# EasyEDA Pro project ProProject_ExtBoard-002_2024-05-18.epro, board PCB-ExtBoard-002
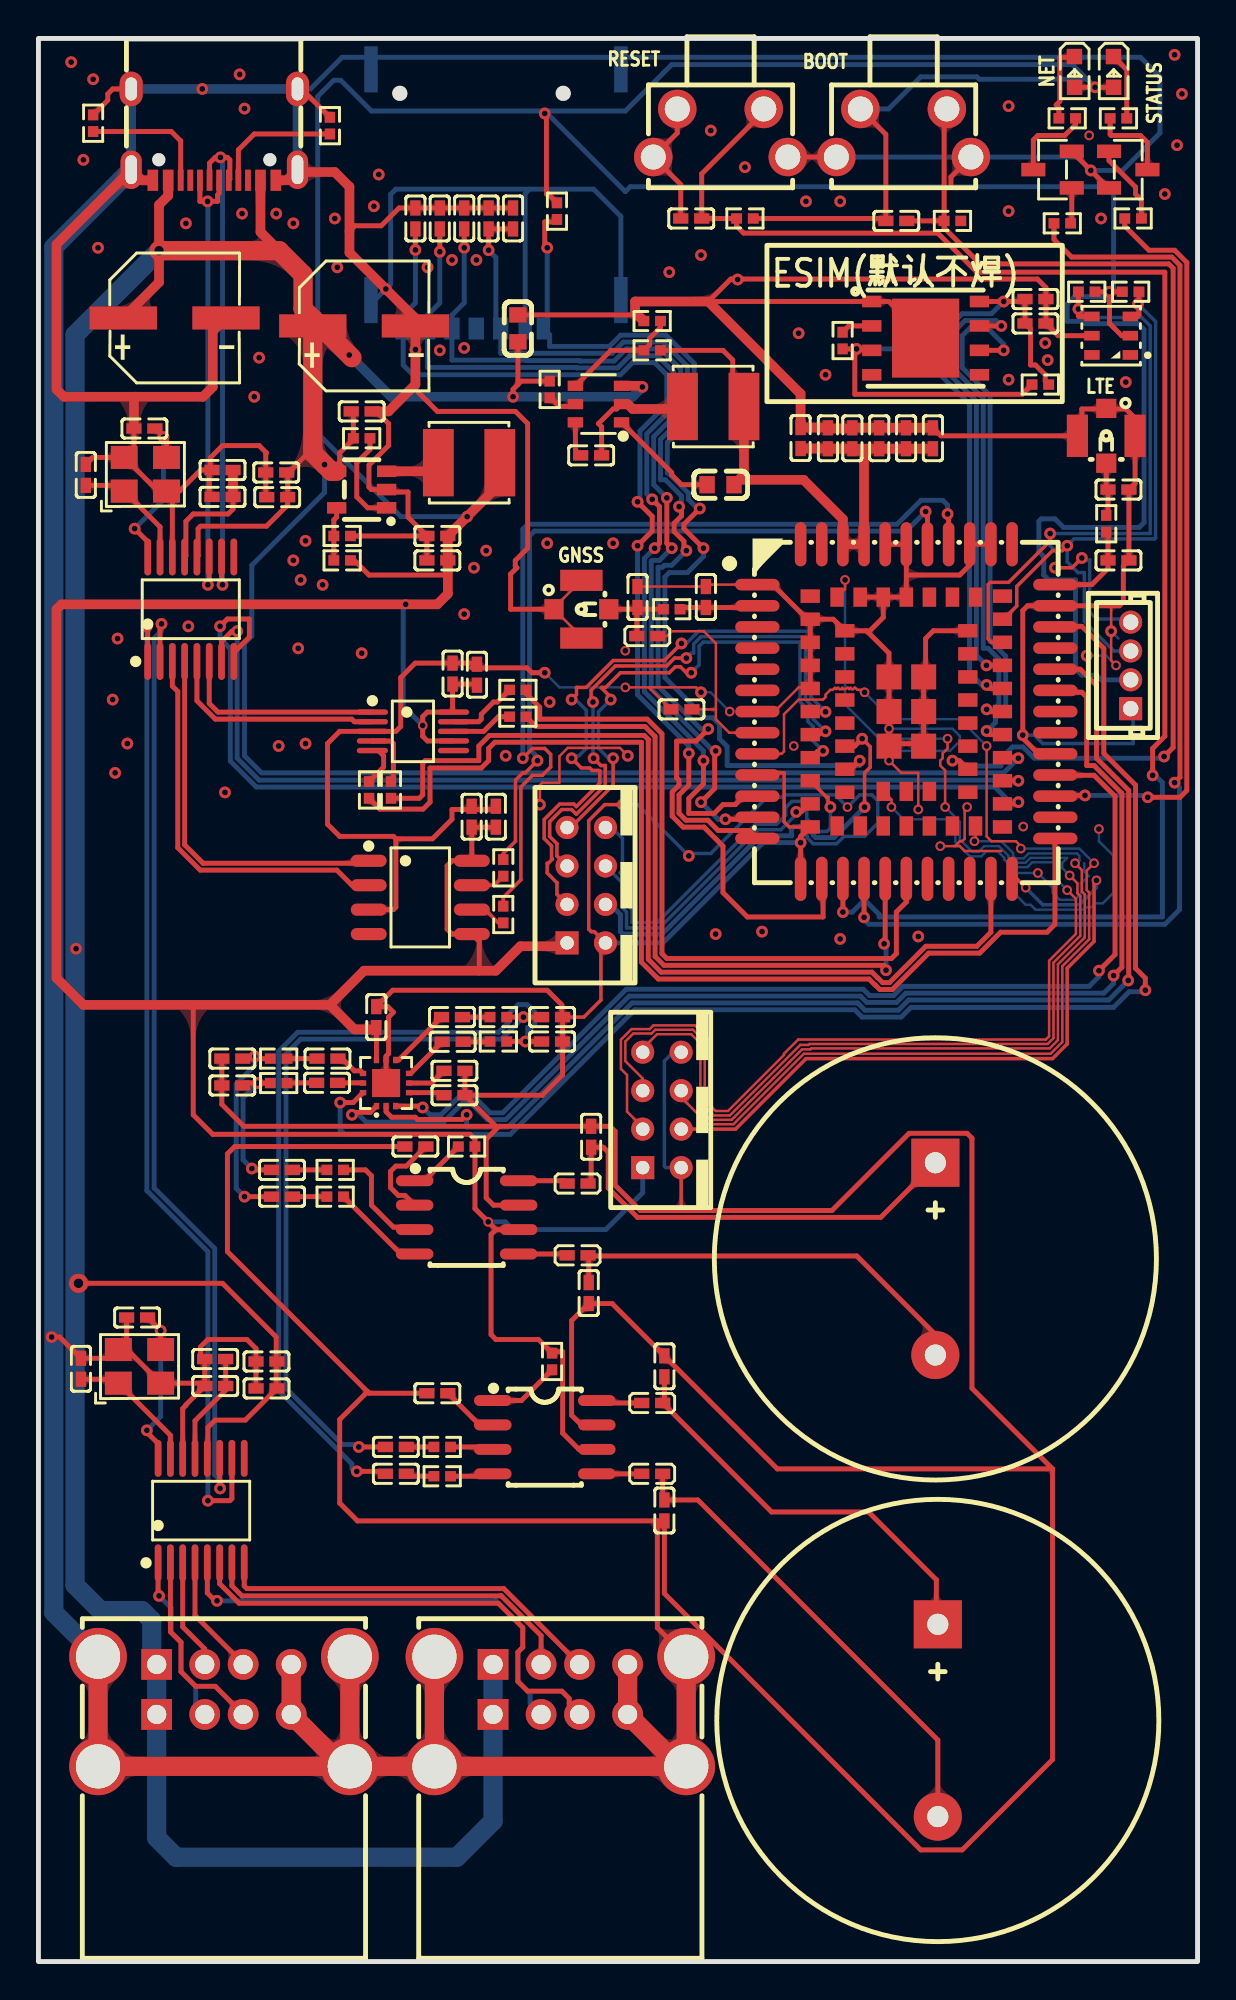
[diagram p5: board, top side]
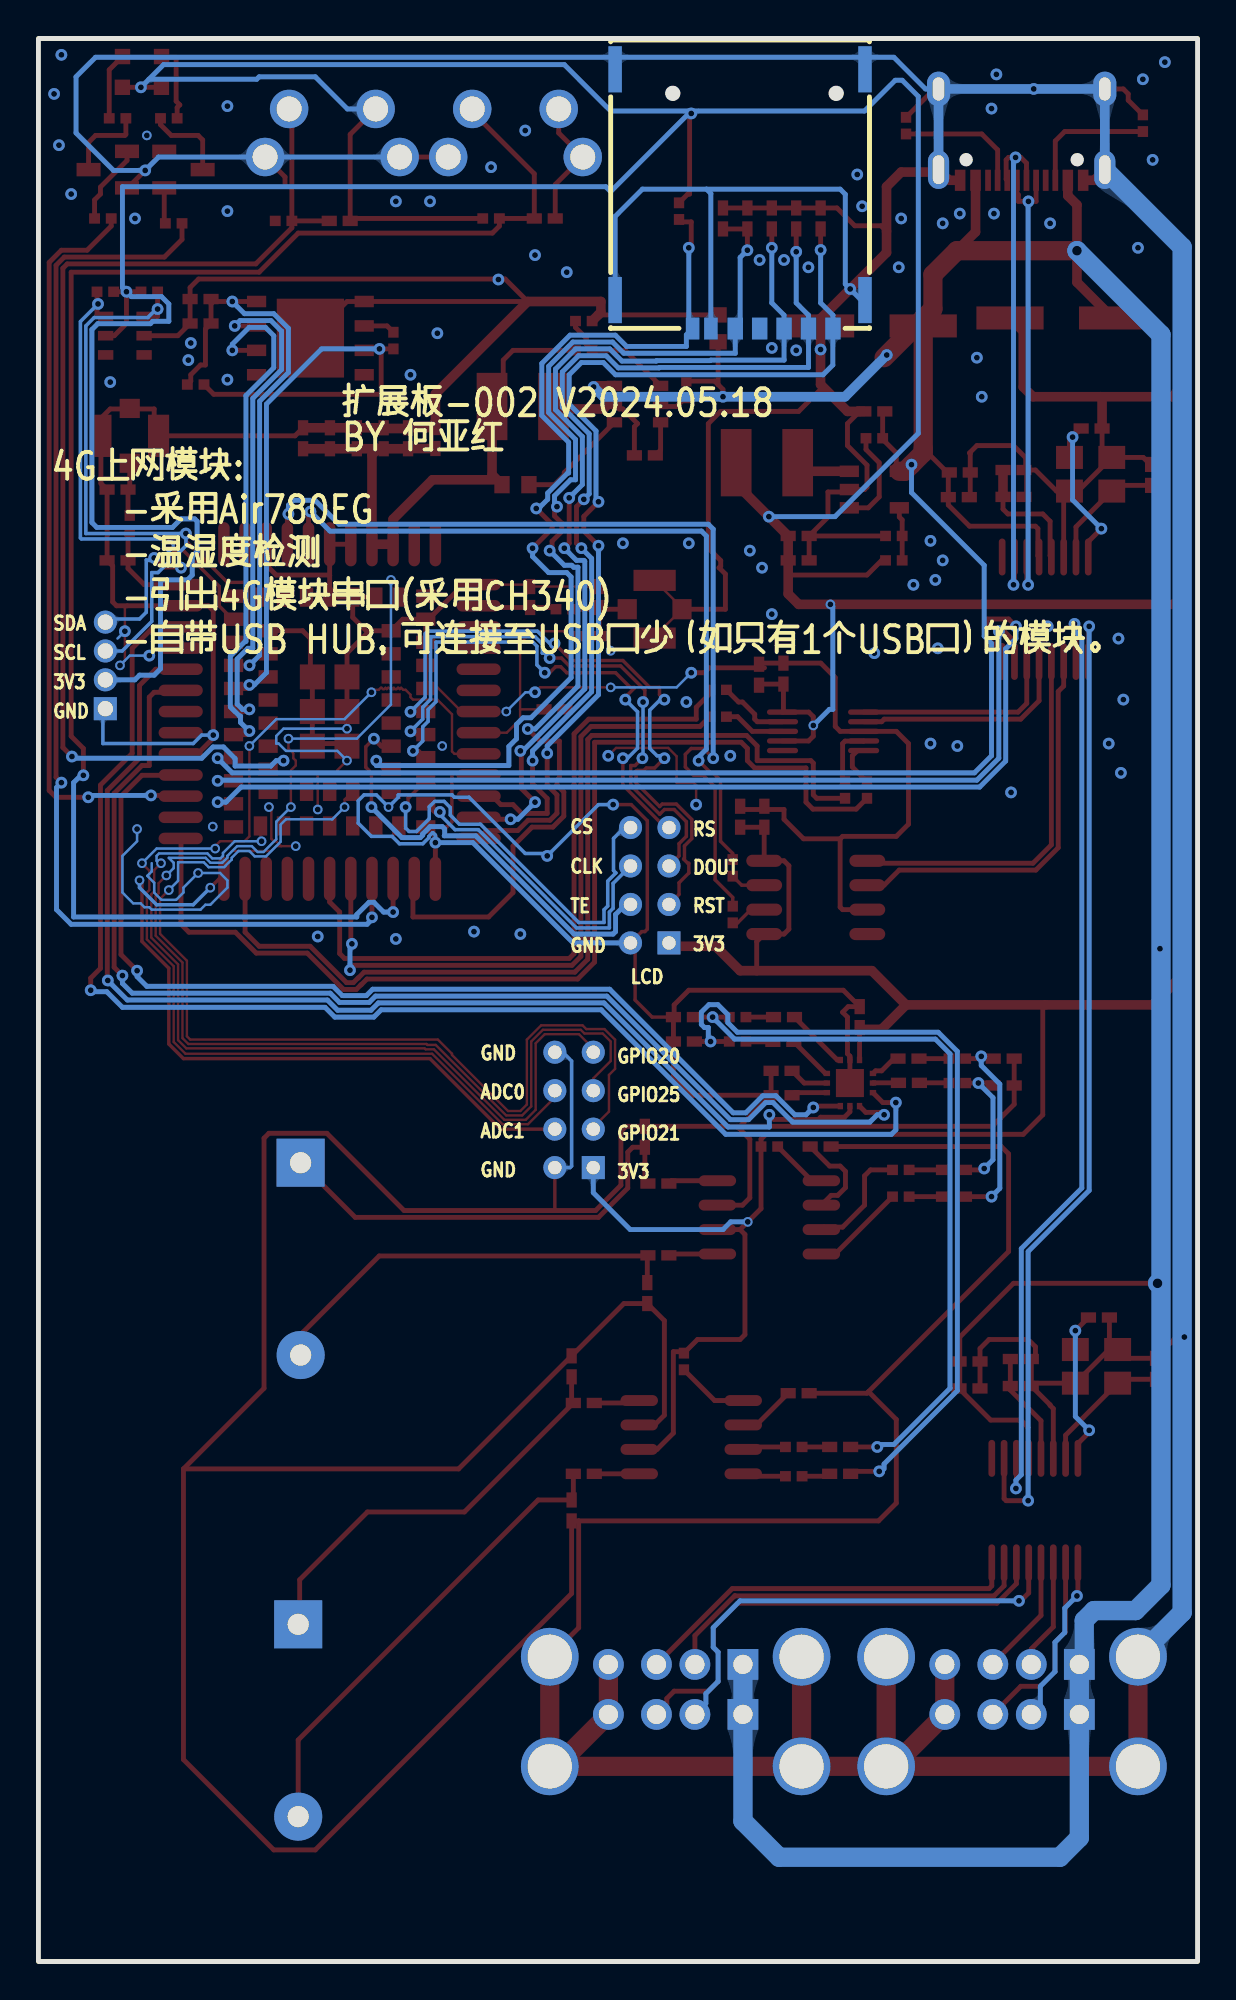
[diagram p6: board, bottom side, seen from below]

Outline 60.3 x 100 mm; copper layers: Top Layer, Bottom Layer. Coordinates in mm from the lower left corner of the outline.
Outline path: rectangle 0,100 60.3,0
Stack: Top Layer 0.035mm / Dielectric1 1.51mm FR4 er 4.5 / Bottom Layer 0.035mm

## Design rules (mm)
template: JLCPCB Capability(Two Layers Board)
spacing copperThickness1oz (default): track to track 0.102, other pairs 0.152 to 0.3
spacing copperThickness2oz: track to track 0.203, other pairs 0.152 to 0.3
track width copperThickness1oz (default): min 0.127, default 0.254, max 2.54
track width copperThickness2oz: min 0.203, default 0.254, max 2.54
differential pair differentialPair (default): width min 0.127, default 0.254, max 2.54; gap min 0.152, default 0.152
via viaSize (default): diameter min 0.5, default 0.61, max 10; hole min 0.3, default 0.305, max 6.3

## Placement (name value [footprint] x y rotation side)
C1  20pF  [C0402]  5.51 79.72 0 top
C2  20pF  [C0402]  2.46 77.31 90 top
C3  10uF  [C0402]  9.58 77.56 0 top
C4  100nF  [C0402]  9.58 76.16 0 top
C5  10uF  [C0402]  12.37 77.43 0 top
C6  100nF  [C0402]  12.42 76.15 0 top
C7  100uF  [CAP-SMD_BD6.3-L6.6-W6.6-FD]  7.09 85.47 0 top
C8  100uF  [CAP-SMD_BD6.3-L6.6-W6.6-FD]  16.94 85.05 0 top
C9  20pF  [C0402]  5.13 33.49 0 top
C10  20pF  [C0402]  2.21 30.82 90 top
C11  10uF  [C0402]  9.19 31.33 0 top
C12  100nF  [C0402]  9.2 29.93 0 top
C13  10uF  [C0402]  11.86 31.2 0 top
C14  100nF  [C0402]  11.86 29.8 0 top
C15  100nF  [C0402]  20.75 74.13 0 top
C16  10uF  [C0402]  20.75 72.86 0 top
C17  10uF  [C0402]  16.81 80.61 180 top
C18  100nF  [C0402]  28.75 78.32 0 top
C19  22uF  [C0603]  35.48 76.8 180 top
C20  22uF  [C0603]  24.94 84.92 90 top
C21  100nF  [C0402]  21.54 66.97 90 top
C22  10uF  [C0402]  22.81 66.91 90 top
C23  100nF  [C0402]  33.96 90.64 0 top
C24  100nF  [C0402]  44.63 90.51 0 top
C25  33pF  [C0402]  39.65 79.22 270 top
C26  100nF  [C0402]  41.07 79.21 270 top
C27  10uF  [C0402]  42.34 79.21 270 top
C28  10uF  [C0402]  43.74 79.21 270 top
C29  100nF  [C0402]  45.14 79.21 270 top
C30  33pF  [C0402]  46.53 79.21 270 top
C31  NF  [C0402]  56.19 76.54 180 top
C32  NF  [C0402]  34.72 70.95 270 top
C33  NF  [C0402]  56.19 72.86 180 top
C34  NF  [C0402]  31.17 70.95 270 top
C35  10uF  [C0402]  22.54 59.53 90 top
C36  100nF  [C0402]  23.8 59.53 90 top
C37  10uF  [C0402]  51.87 86.45 180 top
C38  100nF  [C0402]  51.87 85.18 180 top
C39  1uF  [C0402]  21.64 45.05 180 top
C40  1uF  [C0402]  21.64 46.32 180 top
C41  1uF  [C0402]  17.58 49.11 270 top
C42  3.3uF  [C0402]  15.02 45.69 180 top
C43  3.3uF  [C0402]  15.04 46.95 180 top
C44  2.2nF  [C0402]  10.08 45.56 180 top
C45  2.2nF  [C0402]  10.08 46.95 0 top
C46  3.3uF  [C0402]  21.51 49.11 0 top
C47  3.3uF  [C0402]  21.55 47.83 0 top
C48  2.2nF  [C0402]  26.72 49.11 0 top
C49  2.2nF  [C0402]  26.72 47.84 180 top
C50  1uF  [C0402]  20.75 29.55 0 top
C51  100nF  [C0402]  18.59 26.76 0 top
C52  100nF  [C0402]  18.59 25.36 0 top
C55  1uF  [C0402]  19.61 42.38 0 top
C56  100nF  [C0402]  12.67 41.17 0 top
C57  100nF  [C0402]  12.67 39.77 0 top
C60  200pF  [C0402]  32.56 23.46 90 top
C61  200pF  [C0402]  32.56 30.95 90 top
C62  200pF  [C0402]  28.75 42.89 90 top
C63  200pF  [C0402]  28.63 34.76 90 top
C64  33pF  [C0402]  23.42 90.64 90 top
C65  33pF  [C0402]  22.15 90.64 90 top
C66  33pF  [C0402]  19.61 90.64 90 top
C67  33pF  [C0402]  20.88 90.64 90 top
C68  100nF  [C0402]  24.69 90.64 90 top
C69  100nF  [C0402]  33.45 65.11 0 top
CN1  HC-ZH1.5-4A  [CONN-TH_4P-P1.50_HCTL_HC-ZH1.5-4A]  56.82 67.4 90 top
CN2  HC-PHD-2*4A  [CONN-TH_8P-HC-PHD-2-4A]  28.5 55.97 90 top
CN3  HC-PHD-2*4A  [CONN-TH_8P-HC-PHD-2-4A]  32.44 44.28 90 top
L1  4.7uH  [IND-SMD_L4.0-W4.0]  22.4 77.94 0 top
L2  4.7uH  [IND-SMD_L4.0-W4.0]  35.1 80.86 180 top
L3  BLM15PD121SN1D  [L0402]  31.93 29.04 0 top
L4  BLM15PD121SN1D  [L0402]  31.93 25.36 0 top
L5  BLM15PD121SN1D  [L0402]  28.05 40.46 0 top
L6  BLM15PD121SN1D  [L0402]  28.05 36.72 0 top
L7  47nH  [L0402]  31.67 68.92 0 top
LED1  NET  [LED0603-RD_RED]  53.9 98.26 270 top
LED2  STATUS  [LED0603-RD_RED]  55.93 98.26 270 top
Q1  S9013  [SOT-23-3_L2.9-W1.3-P1.90-LS2.4-BR]  52.76 93.18 0 top
Q2  S9013  [SOT-23-3_L2.9-W1.3-P1.90-LS2.4-BR]  56.69 93.18 180 top
R1  5.1kΩ  [R0402]  2.84 95.59 90 top
R2  5.1kΩ  [R0402]  15.16 95.47 90 top
R3  1kΩ  [R0402]  16.81 79.21 180 top
R4  68kΩ  [R0402]  15.8 72.86 180 top
R5  15kΩ  [R0402]  15.8 74.13 0 top
R6  100kΩ  [R0402]  26.59 81.75 90 top
R7  75kΩ  [R0402]  31.93 83.78 180 top
R8  16kΩ  [R0402]  31.93 85.31 180 top
R9  100kΩ  [R0402]  53.26 90.39 180 top
R10  1kΩ  [R0402]  53.52 95.85 180 top
R11  100kΩ  [R0402]  56.95 90.64 180 top
R12  1kΩ  [R0402]  36.75 90.64 180 top
R13  1kΩ  [R0402]  56.19 95.85 0 top
R14  1kΩ  [R0402]  47.55 90.51 180 top
R15  0Ω  [R0402]  55.55 74.77 90 top
R16  0Ω  [R0402]  32.94 70.32 180 top
R17  0Ω  [R0402]  41.83 84.29 90 top
R18  4.7kΩ  [R0402]  52.12 82 0 top
R19  470Ω  [R0402]  12.5 45.68 180 top
R20  470Ω  [R0402]  12.5 46.95 180 top
R21  470Ω  [R0402]  23.93 49.11 0 top
R22  470Ω  [R0402]  23.93 47.84 0 top
R23  1kΩ  [R0402]  26.72 31.2 90 top
R24  30kΩ  [R0402]  21.01 26.76 0 top
R25  30kΩ  [R0402]  21.01 25.24 0 top
R26  1kΩ  [R0402]  22.28 42.38 0 top
R27  30kΩ  [R0402]  15.44 41.17 0 top
R28  30kΩ  [R0402]  15.44 39.77 0 top
R29  30kΩ  [R0402]  26.97 91.02 270 top
R30  5.1kΩ  [R0402]  56.82 86.83 0 top
R31  5.1kΩ  [R0402]  54.53 86.83 0 top
R32  1kΩ  [R0402]  24.94 66.13 180 top
R33  1kΩ  [R0402]  24.94 64.73 180 top
R34  1kΩ  [R0402]  24.18 56.87 270 top
R35  1kΩ  [R0402]  24.18 54.44 270 top
R36  1kΩ  [R0402]  18.34 60.92 270 top
R37  1kΩ  [R0402]  17.2 60.92 270 top
RF1  KH-IPEX-K501-29  [ANT-SMD_KH-IPEX-K501-29]  55.55 79.34 180 top
RF2  KH-IPEX-K501-29  [ANT-SMD_KH-IPEX-K501-29]  28.25 70.32 270 top
SIM1  NANO SIM 7P H1.37  [SIM-SMD_NANO-SIM-7P-H1.37]  23.8 91.66 0 bottom
SPK1  GSPK2307P-8R1W  [SPK-TH_BD23.0-P10.00-D0.8-L-RD]  46.79 12.53 270 top
SPK2  GSPK2307P-8R1W  [SPK-TH_BD23.0-P10.00-D0.8-L-RD]  46.66 36.54 270 top
SW1  TS665ZJ  [SW-TH_TS665ZJ]  35.48 95.08 180 top
SW2  TS665ZJ  [SW-TH_TS665ZJ]  45.01 95.08 180 top
U1  CH334R  [QSOP-16_L4.9-W3.9-P0.64-LS6.0-BL]  7.93 70.32 0 top
U2  CH334R  [QSOP-16_L4.9-W3.9-P0.64-LS6.0-BL]  8.46 23.45 0 top
U3  SY8089AAAC  [SOT-23-5_L3.0-W1.7-P0.95-LS2.8-BR]  16.81 76.54 0 top
U4  CH340X  [MSOP-10_L3.0-W3.0-P0.50-LS5.0-BL]  19.48 63.97 270 top
U5  JW5033T  [TSOT-23-6_L2.9-W1.6-P0.95-LS2.8-BR]  29.13 80.99 0 top
U6  AIR780EG  [LCC-109_L17.7-W15.8-P1.10_EC800M-CN]  45.15 65 0 top
U7  CH340N  [SOP-8_L4.9-W3.9-P1.27-LS6.0-BL]  19.86 55.33 270 top
U8  JSGW-eSIM  [TDFN-8_L6.0-W5.0-P1.27-TL-EP]  46.15 84.42 0 top
U9  ES7149  [QFN-12_L2.5-W2.5-P0.50-BL-EP]  18.09 45.68 0 top
U10  EG8305  [SOIC-8_L5.0-W4.0-P1.27-LS6.0-BL]  26.34 27.27 270 top
U11  EG8305  [SOIC-8_L5.0-W4.0-P1.27-LS6.0-BL]  22.28 38.7 270 top
U12  AHT20  [SENSOR-SMD_L3.0-W3.0-P1.00-BR]  55.8 84.54 0 top
USB1  TYPE-C 16PIN 2MD(073)  [USB-C-SMD_TYPE-C-6PIN-2MD-073]  9.15 95 180 top
USB2  AF SS-JB17.6  [USB-A-TH_AF-SS-JB17.6]  27.15 13 0 top
USB3  AF SS-JB17.6  [USB-A-TH_AF-SS-JB17.6]  9.65 13 0 top
X1  12MHz  [OSC-SMD_4P-L3.2-W2.5-BL]  5.56 77.34 0 top
X2  12MHz  [OSC-SMD_4P-L3.2-W2.5-BL]  5.26 30.95 0 top

## Footprints (pads in the part's own frame, mm; a bottom-side part is the same pattern mirrored in y, then rotated)
ANT-SMD_KH-IPEX-K501-29
  rect 1.05x1 smd: 1(0,-1.425) 4(0,1.425)
  rect 1.1x2.2 smd: 2(-1.5,0) 3(1.5,0)
C0402
  rect 0.79x0.54 smd: 1(-0.545,0) 2(0.545,0)
C0603
  rect 0.8x0.9 smd: 1(-0.7,0) 2(0.7,0)
CAP-SMD_BD6.3-L6.6-W6.6-FD
  rect 3.5x1.2 smd: 1(-2.67,0) 2(2.67,0)
CONN-TH_4P-P1.50_HCTL_HC-ZH1.5-4A
  rect 1.2x1.2 hole 0.8: 1(-2.25,0)
  round 1.2 hole 0.8: 2(-0.75,0) 3(0.75,0) 4(2.25,0)
CONN-TH_8P-HC-PHD-2-4A
  rect 1.2x1.2 hole 0.7: 1(-3,1)
  round 1.2 hole 0.7: 2(-1,1) 3(1,1) 4(3,1) 5(3,-1) 6(1,-1) 7(-1,-1) 8(-3,-1)
IND-SMD_L4.0-W4.0
  rect 1.6x3.5 smd: 1(-1.6,0) 2(1.6,0)
L0402
  rect 0.79x0.54 smd: 1(-0.545,0) 2(0.545,0)
LCC-109_L17.7-W15.8-P1.10_EC800M-CN
  oval 2.3x0.6 smd: 1(-7.75,6.6) 2(-7.75,5.5) 3(-7.75,4.4) 4(-7.75,3.3) 5(-7.75,2.2) 6(-7.75,1.1) 7(-7.75,0) 8(-7.75,-1.1) 9(-7.75,-2.2) 10(-7.75,-3.3) 11(-7.75,-4.4) 12(-7.75,-5.5) 13(-7.75,-6.6) 23(7.75,-6.6) 24(7.75,-5.5) 25(7.75,-4.4) 26(7.75,-3.3) 27(7.75,-2.2) 28(7.75,-1.1) 29(7.75,0) 30(7.75,1.1) 31(7.75,2.2) 32(7.75,3.3) 33(7.75,4.4) 34(7.75,5.5) 35(7.75,6.6)
  oval 0.6x2.3 smd: 14(-4.4,-8.7) 15(-3.3,-8.7) 16(-2.2,-8.7) 17(-1.1,-8.7) 18(0,-8.7) 19(1.1,-8.7) 20(2.2,-8.7) 21(3.3,-8.7) 22(4.4,-8.7) 36(4.4,8.7) 37(3.3,8.7) 38(2.2,8.7) 39(1.1,8.7) 40(0,8.7) 41(-1.1,8.7) 42(-2.2,8.7) 43(-3.3,8.7) 44(-4.4,8.7) 95(-5.5,-8.7) 96(5.5,-8.7) 97(5.5,8.7) 98(-5.5,8.7)
  rect 1x0.7 smd: 45(-5,4.8) 46(-5,3.6) 47(-5,2.4) 48(-5,1.2) 49(-5,0) 50(-5,-1.2) 51(-5,-2.4) 52(-5,-3.6) 53(-5,-4.8) 59(5,-4.8) 60(5,-3.6) 61(5,-2.4) 62(5,-1.2) 63(5,0) 64(5,1.2) 65(5,2.4) 66(5,3.6) 67(5,4.8) 73(-3.2,4.2) 74(-3.2,3) 75(-3.2,1.8) 76(-3.2,0.6) 77(-3.2,-0.6) 78(-3.2,-1.8) 79(-3.2,-3) 80(-3.2,-4.2) 81(3.2,-4.2) 82(3.2,-3) 83(3.2,-1.8) 84(3.2,-0.6) 85(3.2,0.6) 86(3.2,1.8) 87(3.2,3) 88(3.2,4.2) 99(-5,6) 100(-5,-6) 103(5,-6) 104(5,6)
  rect 0.7x1 smd: 54(-2.4,-5.95) 55(-1.2,-5.95) 56(0,-5.95) 57(1.2,-5.95) 58(2.4,-5.95) 68(2.4,5.95) 69(1.2,5.95) 70(0,5.95) 71(-1.2,5.95) 72(-2.4,5.95) 101(-3.6,-5.95) 102(3.6,-5.95) 105(3.6,5.95) 106(-3.6,5.95) 107(-1.2,-4.15) 108(0,-4.15) 109(1.2,-4.15)
  rect 1.3x1.3 smd: 89(-0.9,1.8) 90(-0.9,0) 91(-0.9,-1.8) 92(0.9,-1.8) 93(0.9,0) 94(0.9,1.8)
LED0603-RD_RED
  rect 0.8x0.8 smd: 1(-0.799,-0.004) 2(0.799,0.004)
MSOP-10_L3.0-W3.0-P0.50-LS5.0-BL
  oval 0.28x1.62 smd: 1(-1,-2.11) 2(-0.5,-2.11) 3(0,-2.11) 4(0.5,-2.11) 5(1,-2.11) 6(1,2.11) 7(0.5,2.11) 8(0,2.11) 9(-0.5,2.11) 10(-1,2.11)
OSC-SMD_4P-L3.2-W2.5-BL
  rect 1.4x1.2 smd: 1(-1.1,-0.875) 2(1.1,-0.875) 3(1.1,0.875) 4(-1.1,0.875)
QFN-12_L2.5-W2.5-P0.50-BL-EP
  rect 0.28x0.333 smd: 1(-0.5,-1.199) 2(0,-1.199) 3(0.5,-1.199) 7(0.5,1.199) 8(0,1.199) 9(-0.5,1.199)
  rect 0.333x0.28 smd: 4(1.199,-0.5) 5(1.199,0) 6(1.199,0.5) 10(-1.199,0.5) 11(-1.199,0) 12(-1.199,-0.5)
  rect 1.46x1.46 smd: 13(0,0)
QSOP-16_L4.9-W3.9-P0.64-LS6.0-BL
  oval 0.35x1.921 smd: 1(-2.24,-2.716) 2(-1.6,-2.716) 3(-0.96,-2.716) 4(-0.32,-2.716) 5(0.32,-2.716) 6(0.96,-2.716) 7(1.6,-2.716) 8(2.24,-2.716) 9(2.24,2.716) 10(1.6,2.716) 11(0.96,2.716) 12(0.32,2.716) 13(-0.32,2.716) 14(-0.96,2.716) 15(-1.6,2.716) 16(-2.24,2.716)
R0402
  rect 0.566x0.54 smd: 1(-0.433,0) 2(0.433,0)
SENSOR-SMD_L3.0-W3.0-P1.00-BR
  rect 0.8x0.5 smd: 1(1,-1) 2(1,0) 3(1,1) 4(-1,1) 5(-1,0) 6(-1,-1)
SIM-SMD_NANO-SIM-7P-H1.37
  rect 0.8x1.138 smd: 1(0.25,6.74) 2(-2.29,6.74) 3(-4.83,6.74) 6(-1.02,6.74) 7(-3.56,6.74)
  rect 0.7x1.138 smd: 5(1.52,6.74) 8(2.47,6.74)
  rect 0.7x2.4 smd: 9(-6.5,5.26) 10(-6.5,-6.74) 11(6.5,-6.74) 12(6.5,5.26)
SOIC-8_L5.0-W4.0-P1.27-LS6.0-BL
  oval 0.569x1.95 smd: 1(-1.905,-2.705) 2(-0.635,-2.705) 3(0.635,-2.705) 4(1.905,-2.705) 5(1.905,2.705) 6(0.635,2.705) 7(-0.635,2.705) 8(-1.905,2.705)
SOP-8_L4.9-W3.9-P1.27-LS6.0-BL
  oval 0.63x1.865 smd: 1(-1.905,-2.683) 2(-0.635,-2.683) 3(0.635,-2.683) 4(1.905,-2.683) 5(1.905,2.683) 6(0.635,2.683) 7(-0.635,2.683) 8(-1.905,2.683)
SOT-23-3_L2.9-W1.3-P1.90-LS2.4-BR
  rect 1.25x0.7 smd: 1(1,-0.95) 2(1,0.95) 3(-1,0)
SOT-23-5_L3.0-W1.7-P0.95-LS2.8-BR
  rect 1x0.6 smd: 1(1.3,-0.95) 2(1.3,0) 3(1.3,0.95) 4(-1.3,0.95) 5(-1.3,-0.95)
SPK-TH_BD23.0-P10.00-D0.8-L-RD
  rect 2.5x2.5 hole 1.1: 1(-5,0)
  round 2.5 hole 1.1: 2(5,0)
SW-TH_TS665ZJ
  round 2 hole 1.3: 1(-2.25,-1.25) 2(2.25,-1.25) 3(-3.5,1.25) 4(3.5,1.25)
TDFN-8_L6.0-W5.0-P1.27-TL-EP
  rect 1x0.6 smd: 1(-2.8,1.905) 2(-2.8,0.635) 3(-2.8,-0.635) 4(-2.8,-1.905) 5(2.8,-1.905) 6(2.8,-0.635) 7(2.8,0.635) 8(2.8,1.905)
  rect 3.5x4.1 smd: 9(0,0)
TSOT-23-6_L2.9-W1.6-P0.95-LS2.8-BR
  rect 0.8x0.532 smd: 1(1.2,-0.95) 2(1.2,0) 3(1.2,0.95) 4(-1.2,0.95) 5(-1.2,0) 6(-1.2,-0.95)
USB-A-TH_AF-SS-JB17.6
  rect 1.6x1.6 hole 1: 1(-3.5,2.45) 5(-3.5,-0.15)
  round 1.6 hole 1: 2(-1,2.45) 3(1,2.45) 4(3.5,2.45) 6(-1,-0.15) 7(1,-0.15) 8(3.5,-0.15)
  round 3 hole 2.3: 9(-6.55,2.85) 10(6.55,2.85) 11(-6.55,-2.85) 12(6.55,-2.85)
USB-C-SMD_TYPE-C-6PIN-2MD-073
  rect 0.55x1.1 smd: 1(-3.2,2.375) 2(-2.4,2.375) 11(2.4,2.375) 12(3.2,2.375)
  rect 0.3x1.1 smd: 3(-1.75,2.375) 4(-1.25,2.375) 5(-0.75,2.375) 6(-0.25,2.375) 7(0.25,2.375) 8(0.75,2.375) 9(1.25,2.375) 10(1.75,2.375)
  oval 1.1x2 hole 0.6x1.5: 13(-4.325,1.825) 14(4.325,1.825)
  oval 1.2x1.8 hole 0.6x1.2: 13(-4.325,-2.375) 14(4.325,-2.375)

## Nets
As in the schematic.

Pads without a net: SIM1 6; U1 9; U2 9; U4 6; U6 3 4 5 6 24 28 29 44 54 55 56 57 58 68 69 74 75 76 77 80 81 83 84 85 86 87 97 98 99 101 103 104 105 108 109; U7 4; U8 4 5; U12 1 6; USB1 3 9

## Via types
v1: diameter 0.61, hole 0.305, Top Layer to Bottom Layer, 191 vias
v2: diameter 0.5, hole 0.305, Top Layer to Bottom Layer, 32 vias
v3: diameter 1, hole 0.5, Top Layer to Bottom Layer, 2 vias

## Routing (per net, layer and track width the routed paths; a pad name or vN(x,y) marks a point on that pad's centre or on a via; arc(x,y) is an arc through that point)
3V3: length 345.9
  Top Layer w0.254: U10.6 28.12,26.63 27.27,27.48 27.27,31.71 26.8,31.71 R23.2 26.01,32.35 23.8,32.35 23.55,32.6 23.55,37.81 23.8,38.06 ; 22.94,51.52 22.94,53.04 U7.5 21.51,53.43 21.26,53.68 21.26,56.98 21.51,57.24 U7.8 22.55,58.97 C35.1 23.79,58.98 ; R29.1 26.52,91.91 26.43,91.91 26.43,96.02 v1(26.34,96.1) ; U9.9 17.59,48.56 C41.2 ; LED1.2 v1(54.97,97.46) LED2.2 ; 23.8,38.06 U11.6 ; 23.8,38.06 v2(23.4,38.46) 22.71,39.15 R26.2 22.71,42.76 22.46,43.02 9.07,43.02 8.05,44.03 8.05,49.61 7.91,49.75 ; U4.7 20.24,63.47 19.99,63.72 v2(19.99,64.28) 19.99,64.73 20.23,64.97 U4.10 21.54,65.02 C21.1 22.75,66.43 C22.1 ; v1(55.72,86.83) R30.1 ; v1(55.72,86.83) 55.72,85.18 56.36,84.54 U12.2 ; v1(55.72,86.83) R31.2 ; 42.76,96.34 44.08,95.01 44.08,90.51 43.96,90.64 R12.1 ; C16.2 21.26,72.82 21.26,72.22 21.13,72.1 17.2,72.1 16.43,72.86 R4.1
  Top Layer w0.5: 15.16,49.75 16.94,51.52 23.8,51.52 25.07,52.79 27.32,52.79 CN2.1 ; 15.16,49.75 16.43,48.48 17.49,48.48 C41.2 ; 15.16,49.75 2.34,49.75 0.94,51.14 0.94,70.32 1.19,70.57 v2(19.1,70.57) 20.75,70.57 21.3,71.12 C16.2 C15.2 v1(22.3,75.13) 24,76.84 L1.2
  Bottom Layer w0.254: CN1.2 55.28,66.65 55.04,66.89 54.28,66.89 53.95,67.22 53.95,71.84 52.55,71.84 52.3,72.1 52.3,73.06 52.04,73.32 52.04,74.89 52.17,75.02 52.88,75.02 53.33,74.57 57.26,74.57 57.52,74.83 57.52,84.86 57.21,85.17 54.47,85.17 54.35,85.29 53.52,85.29 53.52,86.19 53.9,86.58 55.47,86.58 v1(55.72,86.83) 55.93,87.04 55.93,92.29 30.78,92.29 30.53,92.04 26.47,96.1 v1(26.34,96.1) ; v1(22.3,75.13) 18.86,75.13 14.53,79.46 14.53,96.99 15.37,97.83 15.72,97.83 17.32,96.23 30.53,96.23 32.94,98.64 53.79,98.64 54.55,97.88 ; CN3.1 31.44,39.98 29.52,38.06 24.69,38.06 24.29,38.46 v2(23.4,38.46) ; 54.55,97.88 48.95,97.88 48.82,98.01 45.9,98.01 44.23,96.34 42.76,96.34 ; 54.55,97.88 v1(54.97,97.46) ; v2(19.99,64.28) 19.15,65.11 18.97,65.11 18.97,70.45 v2(19.1,70.57)
GND: length 980.5
  Top Layer w0.127: v1(34.47,66) 34.21,66.26 31.76,66.26 ; v2(46.91,58) 47.68,58 ; 47.68,58 47.93,58 48.18,57.75 50.09,57.75 ; 47.68,58 47.93,58.25 48.06,58.25 48.18,58.38 48.18,59.91 v2(48.31,60.03) ; RF2.2 26.82,70.39 RF2.1 28.25,68.89 RF2.3 ; v2(56.06,67.4) 55.8,67.65 v1(55.8,69.18) 55.8,70.38 55.68,70.5 ; U6.1 34.82,71.6 C32.1 C34.1 ; v1(26.09,60.16) 26.09,61.18 26.21,61.3 27.1,61.3 27.1,62.67 27.54,63.11 30.25,63.11 v1(30.66,62.7) ; v2(45.77,59.91) 45.77,61.81 44.89,61.81 v2(44.25,62.45) ; 31.76,66.26 v2(30.53,66.26) ; 31.76,66.26 C69.1 ; U6.7 38.29,65 39.55,66.26 40.09,66.26 U6.48
  Top Layer w0.18: U6.100 39.06,59 38.79,59.26 38.79,61.81 37.51,61.81 U6.10 ; CN3.8 33.44,39.08 33.41,39.05 ; v1(30.4,60.16) 29.46,60.16 28.63,59.32 28.63,53.68 28.75,53.56 28.91,53.56 CN2.8 29.26,52.73 29.26,50 28.37,49.11 C48.2
  Top Layer w0.254: U1.14 6.97,76.16 6.66,76.46 ; Q1.2 v1(54.75,93.14) 55.66,92.23 Q2.2 ; 8.89,77.56 8.89,76.3 C4.1 ; 8.89,77.56 C3.1 ; 8.89,77.56 8.43,77.56 7.34,76.46 6.66,76.46 ; v1(26.34,67.02) 25.67,67.02 25.41,67.27 22.53,67.27 ; R5.2 20.21,74.13 ; 20.21,74.13 19.23,75.11 19.23,76.42 18.24,76.42 U3.2 17.32,76.54 17.2,76.67 17.2,77.81 18.21,78.83 18.21,79.97 17.58,80.61 ; 20.21,74.13 20.21,72.86 ; 33.41,90.64 33.41,92.4 SW1.4 33.23,95.09 33.23,96.34 ; U5.1 32.94,77.43 32.94,77.31 33.45,76.8 C19.2 ; 8.65,29.93 8.5,30.07 X2.2 4.61,31.82 X2.4 ; 8.65,29.93 C12.1 ; 8.65,29.93 C11.1 8.43,31.55 8.43,31.97 8.81,32.35 10.85,32.35 11.32,31.88 C13.1 11.32,29.8 C14.1 ; 8.65,29.93 7.67,28.95 7.67,28.92 7.5,28.75 7.5,26.16 ; C20.2 31.18,85.62 ; 19.61,82.01 19.61,81.75 20.75,80.61 24.82,80.61 25.45,79.97 25.45,73.5 24.81,72.85 24.81,72.56 24.89,72.48 24.56,72.15 24.56,70.32 RF2.1 ; 18.59,58.38 20.5,58.38 21.51,59.4 21.51,59.91 23.62,59.91 C36.2 ; 18.59,58.38 18.47,58.51 15.67,58.51 15.04,59.14 15.04,63.33 15.67,63.97 U4.3 18.59,63.97 18.85,64.22 18.85,66.76 19.6,67.52 C21.2 22.75,67.52 C22.2 ; 18.59,58.38 18.59,54.83 18.47,54.7 U7.3 ; X2.4 3.7,31.37 C10.2 1.1,32.47 v1(0.69,32.47) ; X2.4 4.59,32.25 C9.1 ; 43.17,69.11 43.95,69.9 U6.71 ; 43.17,69.11 43.08,69.2 U6.73 41.35,69.8 U6.45 ; 43.17,69.11 44.25,68.03 44.25,66.8 U6.89 U6.90 v2(44.25,64.11) U6.91 ; R1.2 3.61,96.79 3.61,97.12 3.87,97.38 USB1.14 ; C1.1 4.97,78.72 X1.4 ; 23.96,43.43 C62.2 29.73,43.43 30,43.17 30,40.37 31.31,39.05 41.28,39.05 45.29,43.07 48.31,43.07 48.56,42.81 48.56,29.81 52.76,25.62 ; 23.96,43.43 23.29,42.76 23.29,39.71 23.67,39.33 U11.7 ; 23.96,43.43 23.8,43.43 ; X1.4 6.21,76.46 6.66,76.46 ; X1.4 2.83,78.21 C2.2 ; 17.12,29.63 17.2,29.55 20.21,29.55 ; 17.12,29.63 9.83,36.92 9.83,42 10.21,42.38 C55.1 ; 17.12,29.63 15.67,28.19 15.67,23.84 16.6,22.91 32.2,22.91 ; 45.15,72.07 U6.70 U6.71 ; 45.15,72.07 45.18,72.1 47.93,72.1 48.45,72.62 U6.37 U6.36 ; 45.15,72.07 U6.40 U6.41 ; U6.72 U6.71 ; U9.13 U9.8 18.09,47.08 18.21,47.21 18.21,49.11 18.47,49.36 18.18,49.66 C41.1 18.43,50.51 26.47,50.51 27.23,49.75 27.23,49.15 C48.2 C49.1 27.27,46.1 26.21,45.05 C39.1 ; C39.1 23.8,43.43 ; C39.1 C40.1 ; 47.47,92.42 47.47,92.8 SW2.3 ; 23.8,43.43 10.68,43.43 9.54,44.58 C44.2 C45.1 ; C6.1 11.83,76.2 C5.1 11.83,78.41 11.86,78.45 11.48,78.83 9.58,78.83 8.94,78.19 8.94,77.69 ; 55.52,80.73 54.28,80.73 54.28,79.57 RF1.3 46.95,79.34 C30.1 ; 55.52,80.73 56.57,80.73 57.05,80.25 RF1.2 57.05,76.86 C31.1 C33.1 56.44,72.57 56.44,70.7 56.24,70.5 U6.34 51.46,70.5 51.21,70.25 51.21,63.61 52.02,62.8 U6.27 ; 55.52,80.73 RF1.1 ; U6.45 U6.46 U6.47 U6.48 ; U6.45 40,69.8 38.2,71.6 U6.1 ; 45.91,63.33 U6.92 ; 45.91,63.33 46.05,63.47 U6.93 U6.94 46.15,66.9 46.15,68.8 46.56,69.2 U6.88 ; 45.91,63.33 44.37,63.33 ; 52.76,25.62 38.44,25.62 29.84,34.22 C63.1 27.74,33.33 27.74,28.41 28.25,27.9 U10.7 ; 52.76,25.62 52.76,10.5 48.06,5.8 45.9,5.8 32.56,19.14 C60.1 32.2,22.91 ; 34.98,86.45 36.02,87.49 51.97,87.49 52.41,87.05 C37.1 C38.1 53.05,84.54 U12.5 ; U8.9 44.25,86.32 U8.1 35.1,86.32 ; SW1.3 SW2.4 ; 32.2,22.91 32.2,17.35 USB2.10 ; USB1.13 13.73,97.12 13.95,97.12 R2.2 ; C68.2 C64.2 C65.2 C67.2 C66.2 18.76,91.19 17.83,90.26 16.47,90.26 16.18,89.97 ; U6.100 39.65,58.5 v1(39.65,58.18) U6.95
  Top Layer w0.5: C30.1 C29.1 C28.1 C27.1 42.31,79.72 41.2,79.72 ; USB1.12 5.38,92.62 USB1.14 0.94,89.29 0.94,81.75 1.32,81.37 5.04,81.37 ; C7.2 9.07,84.78 9.07,81.88 8.56,81.37 5.04,81.37 ; C26.1 41.06,79.77 C25.1 39.65,81.52 34.85,86.32 31.04,86.32 31.04,85.76 R8.2 ; 5.04,81.37 4.97,81.3 C1.1 ; USB1.1 12.93,92.62 USB1.13 13.6,93.05 15.42,93.05 16.18,92.29 16.18,88.86 v1(18.07,86.97) 19.61,85.43 v1(19.61,83.83) 19.61,82.01 18.21,80.61 C17.1
  Top Layer w1: 33.35,10.15 USB2.8 USB2.4 ; 33.35,10.15 USB2.11 ; 33.35,10.15 USB2.12 USB2.10 ; 15.85,10.15 USB3.8 USB3.4 ; 15.85,10.15 USB3.11 USB3.9 ; 15.85,10.15 USB3.12 ; USB3.12 USB3.10 ; USB3.12 USB2.11 ; USB2.11 USB2.9
  Bottom Layer w0.127: 54.41,57.11 54.41,56.68 54.64,56.45 54.28,56.1 54.28,55.59 53.9,55.21 53.14,55.21 52.76,55.59 52.76,55.84 v2(51.99,56.6) 50.85,56.6 50.47,56.22 50.47,55.84 51.36,54.95 51.61,54.95 51.87,54.7 54.41,54.7 54.53,54.83 54.79,54.83 54.99,55.03 55.37,55.03 55.93,55.59 55.93,57.49 55.17,58.25 v2(55.17,58.89) ; v2(56.06,67.4) 55.55,67.91 v1(54.53,67.91) ; v2(35.96,65) 34.96,66 v1(34.47,66) ; v2(30.53,66.26) 27.1,66.26 v1(26.34,67.02) ; v1(55.8,69.18) 56.19,68.8 ; v2(44.25,62.45) 44.75,62.95 47.42,62.95 47.8,63.33 47.93,63.33 47.93,63.73 47.55,64.11 v2(44.25,64.11)
  Bottom Layer w0.18: CN3.8 32.64,41.28 32.56,41.36 32.56,46.83 33.02,47.28 CN3.5 ; v1(30.4,60.16) 31.17,60.16 v1(33.83,57.49) 33.96,57.62 34.98,57.62 37.9,60.54 38.66,60.54 38.79,60.67 41.58,60.67 41.58,60.54 v2(42.09,60.03) 42.72,60.67 43.36,60.67 43.66,60.36 43.66,59.2 42.98,58.51 41.9,58.51 41.52,58.13 40.31,58.13 39.99,58.44 39.99,58.5 39.8,58.7 39.77,58.7 39.65,58.58 v1(39.65,58.18) ; v1(51.21,63.77) 51.81,63.77 52.25,63.33 56.95,63.33 56.95,65.02 57.07,65.15
  Bottom Layer w0.254: v1(39.65,58.18) 37.7,58.18 32.48,52.97 CN2.8 ; SIM1.12 30.3,90.74 28.88,92.16 25.55,92.16 ; SIM1.5 25.32,91.94 25.55,92.16 ; 25.55,92.16 18.59,92.16 18.33,91.9 18.33,87.23 v1(18.07,86.97) 17.49,86.4 SIM1.9 ; USB1.13 14.15,97.38 15.8,99.02 57.33,99.02 58.34,98.01 58.34,95.08 56.4,93.14 v1(54.75,93.14) 54.05,93.83 SW2.3 SW2.4
  Bottom Layer w0.5: USB1.14 USB1.14 v1(8.52,97.38) USB1.13 USB1.13
  Bottom Layer w1: USB3.9 0.8,18.15 0.8,89.15 USB1.14
  vias: v1(1.7,98.77) v1(2.34,93.69) v1(2.84,97.88) v1(3.1,89.12) v1(3.86,65.62) v1(3.99,61.81) v1(4.12,68.8) v1(4.62,63.33) v1(7.67,90.39) v1(7.8,69.43) v1(9.7,60.8) v1(10.47,98.13) v1(10.59,90.89) v1(10.72,96.35) v1(11.23,81.37) v1(11.48,83.4) v1(12.37,90.89) v1(12.5,63.21) v1(13.26,90.39) v1(13.26,72.86) v1(13.51,68.29) v1(13.64,71.84) v1(13.89,73.88) v1(13.89,63.33) v1(14.78,71.59) v1(15.42,90.64) v1(15.55,88.1) v1(16.81,68.03) v1(17.45,91.28) v1(17.7,92.93) v1(20.24,88.1) v1(20.88,83.78) v1(21.51,88.48) v1(22.15,83.91) v1(22.15,70.07) v1(22.66,72.48) v1(22.78,88.48) v1(23.29,73.37) v1(24.31,62.7) v1(26.47,73.75) v1(26.59,65.49) v1(29.9,73.75) v1(32.82,87.85) v1(34.47,88.73) v1(34.98,95.21) v1(35.23,53.43) v1(36.37,87.47) v1(36.75,93.31) v1(37.64,53.56) v1(39.55,84.67) v1(39.93,91.53) v1(40.94,82.51) v1(41.71,91.53) v1(41.71,53.17) v1(45.77,53.3) v1(50.47,96.48) v1(50.47,91.02) v1(50.47,82.26) v1(52.38,84.16) v1(52.5,83.27) v1(55.28,90.64) v1(56.57,82.13) v1(58.6,91.91) v1(59.11,99.15) v1(59.23,94.45) v1(59.49,97.12) v2(30.53,68.16) v2(39.29,63.21) v2(51.23,59.02) v2(54.66,94.96)
VBAT: length 31.4
  Top Layer w0.254: 32.36,83.78 35.61,83.78 36.12,83.27 36.12,81.44 L2.1
  Top Layer w0.5: 42.63,78.67 C28.2 C29.2 C30.2 ; 42.63,78.67 C27.2 C26.2 41.06,78.68 C25.2 ; 42.63,78.67 42.95,78.35 U6.42 U6.43 41.85,75 39.8,77.05 36.63,77.05 ; L2.1 36.7,77.32 C19.1
ADC0: length 59.5
  Top Layer w0.127: v2(49.33,63.21) 49.33,58.51 49.58,58.25 50.85,58.25 51.11,58 ; v2(42.98,66) 42.85,66.13 42.6,66.13 42.49,66.23 42.45,66.23 42.38,66.17 42.32,66.17 42.25,66.23 42.18,66.17 42.11,66.23 42.07,66.23 42,66.17 41.83,66.17 41.83,66.21 41.81,66.23 41.74,66.17 41.67,66.17 41.6,66.23 41.57,66.23 41.5,66.17 41.43,66.24 41.33,66.13 41.2,66.13 40.94,65.88 40.94,65.75 40.82,65.62 39.55,65.62 38.79,64.86 38.79,62.93 38.66,62.8 U6.9 ; v2(54.91,57.11) 54.53,56.73 54.53,55.72 54.66,55.59 54.66,53.15 53.26,51.76 53.26,47.82 52.65,47.21 39.82,47.21 36.16,43.54 34.83,43.54 33.44,44.94 CN3.6
  Bottom Layer w0.127: v2(54.91,57.11) 54.15,57.87 v2(51.11,57.87) ; v2(42.98,66) 44.37,64.61 47.93,64.61 v2(49.33,63.21)
ADC1: length 36.7
  Top Layer w0.18: CN3.7 36.26,43.28 39.93,46.95 52.76,46.95 53.52,47.71 53.52,51.65 54.91,53.05 54.91,56.22 ; U6.96 50.9,56.3 v2(51.36,55.84)
  Bottom Layer w0.18: v2(55.04,56.22) 55.04,55.84 54.15,54.95 52.25,54.95 v2(51.36,55.84)
D-RXD: length 47.8
  Top Layer w0.18: v1(25.2,62.57) 25.71,63.08 26.34,63.08 26.65,62.77 26.65,62.12 26.21,61.68 25.71,61.68 25.1,61.08 25.1,56.25 24.18,55.33 R35.1
  Top Layer w0.254: v1(47.3,75.27) 47.35,75.22 U6.38
  Bottom Layer w0.254: v1(25.2,62.57) 25.2,74.49 25.45,74.74 44.66,74.74 45.91,75.98 47.04,75.98 47.3,75.73 v1(47.3,75.27)
D-TXD: length 40.7
  Top Layer w0.18: v1(25.96,62.45) 25.32,61.81 25.2,61.81 24.82,61.43 24.82,58.25 24.18,57.62 R34.1
  Top Layer w0.254: v1(46.15,75.4) 46.25,75.3 U6.39
  Bottom Layer w0.254: v1(25.96,62.45) 25.96,62.64 25.55,63.04 25.55,74.13 25.81,74.38 45.14,74.38 v1(46.15,75.4)
DM1: length 50.6
  Top Layer w0.254: U1.7 9.53,68.64 10.06,69.18 v1(10.34,69.18) ; v1(50.98,61.4) U6.60
  Bottom Layer w0.254: v1(50.98,61.4) 50.95,61.43 11.48,61.43 10.34,62.57 v1(10.34,69.18)
DM2: length 11.6
  Top Layer w0.254: U4.2 16.44,64.47 16.3,64.61 9.2,64.61 8.25,65.56 U1.5
DM3: length 20.5
  Top Layer w0.254: 17.18,55.97 16.31,55.97 15.52,56.76 8.41,56.76 7.25,57.92 7.25,66.04 6.97,66.33 U1.3
DM4: length 51.9
  Top Layer w0.254: v1(8.81,23.97) 9.96,23.97 10.06,24.07 10.06,26.16 ; U1.1 5.69,69.26 5.64,69.3
  Bottom Layer w0.254: v1(8.81,23.97) 8.81,36.92 5.64,40.09 v1(5.64,69.43)
DM-UP: length 27.1
  Top Layer w0.254: U1.10 9.53,71.46 ; USB1.5 9.96,92.68 9.96,93.69 9.83,93.81 9.19,93.81 8.9,93.52 USB1.7
  Bottom Layer w0.254: v1(9.58,71.59) 9.58,93.71 v1(9.47,93.81)
DP1: length 54.2
  Top Layer w0.254: v1(9.45,69.43) 9.83,69.81 10.97,69.81 10.97,68.87 10.16,68.06 10.16,67.6 ; U6.59 50.98,60.2
  Bottom Layer w0.254: v1(9.45,69.43) 9.45,68.8 9.98,68.26 9.98,62.43 11.33,61.07 49.76,61.07 50.55,60.29 v1(50.98,60.29)
DP2: length 10.9
  Top Layer w0.254: U1.6 8.89,65.42 9.34,64.97 U4.1
DP3: length 19.6
  Top Layer w0.254: U1.4 7.61,58.07 8.56,57.11 17.05,57.11 U7.1
DP4: length 50
  Top Layer w0.254: 9.42,26.16 9.42,24.62 v1(9.45,24.6) ; 6.27,69.43 6.33,69.38 U1.2
  Bottom Layer w0.254: v1(9.45,24.6) 9.45,25.03 9.17,25.31 9.17,37.07 6.02,40.22 6.02,68.82 6.4,69.2 v1(6.4,69.56)
DP-UP: length 24.7
  Top Layer w0.254: U1.11 8.89,71.46 ; USB1.8 8.4,91.53 v1(8.8,91.53) 9.32,91.53 9.32,91.87 9.4,91.95 USB1.6
  Bottom Layer w0.254: v1(8.8,91.53) 8.81,91.51 v1(8.81,71.59)
GPIO20: length 45
  Top Layer w0.127: U6.102 48.75,58.44 48.69,58.38 v2(48.69,58.25) ; CN3.4 31.44,47.48 32.18,48.22 33.96,48.22 34.43,47.75 34.43,44.29 34.95,43.77 36.06,43.77 39.73,47.44 40.16,47.44 40.21,47.48 52.61,47.48 53.03,47.91 53.03,51.85 54.43,53.25 54.43,55.49 54.28,55.64 54.28,56.76 v2(53.93,57.11)
  Bottom Layer w0.127: 54.03,57.11 54.15,57.24 54.15,57.49 54.03,57.62 51.51,57.62 51.26,57.37 50.83,57.37 50.7,57.49 50.7,57.64 50.09,58.25 v2(48.69,58.25)
GPIO21: length 54.9
  Top Layer w0.127: U6.107 44.37,60.43 v2(44.37,60.03) ; CN3.2 31.44,43.38 30.62,44.2 30.62,46.1 30.3,46.42 30.3,47.94 30.85,48.49 31.8,48.49 31.99,48.68 34.15,48.68 34.89,47.94 34.89,44.57 35.23,44.23 35.87,44.23 38.79,47.14 38.79,47.21 39.52,47.94 52.41,47.94 52.58,48.11 52.58,52.04 53.97,53.44 53.97,55.26 v2(53.52,55.72)
  Bottom Layer w0.127: 53.39,55.84 53.03,56.2 53.03,57.16 51.7,57.16 51.45,56.91 50.64,56.91 50.24,57.3 50.24,57.4 49.89,57.75 49.33,57.75 49.05,57.47 48.46,57.47 47.7,58.23 47.7,59.12 47.42,59.4 45.01,59.4 v2(44.37,60.03)
GPIO25: length 67.3
  Top Layer w0.127: v2(47.17,60.03) 47.17,61.94 46.91,62.19 46.91,62.45 47.04,62.57 47.04,62.83 47.3,63.08 v2(47.3,63.59) ; v2(41.96,71.84) 41.96,71.36 U6.106 ; v2(53.65,56.48) 54.05,56.07 54.05,55.55 54.2,55.4 54.2,53.34 52.81,51.95 52.81,48.02 52.5,47.71 40.11,47.71 40.06,47.66 39.63,47.66 35.97,44 35.14,44 34.66,44.47 34.66,47.84 34.06,48.45 32.09,48.45 31.89,48.26 30.95,48.26 30.53,47.84 30.53,46.83 31.44,45.92 CN3.3
  Bottom Layer w0.127: 47.17,63.59 43.74,63.59 41.96,65.37 v2(41.96,71.84) ; v2(47.17,60.03) 47.93,59.27 47.93,58.36 48.59,57.7 48.9,57.7 49.2,58 49.96,58 50.47,57.49 ; 53.77,56.6 53.52,56.6 53.26,56.86 53.26,57.14 53.52,57.39 51.6,57.39 51.35,57.14 50.73,57.14 50.47,57.4 50.47,57.49
HUB_DM1: length 19.9
  Top Layer w0.254: USB2.2 26.15,16.95 24.07,19.03 24.05,19.01 10.59,19.01 10.06,19.54 10.06,20.73
HUB_DM2: length 23.7
  Top Layer w0.254: 9.19,18.76 8.78,19.17 8.78,20.73
  Bottom Layer w0.254: v1(9.29,18.76) 23.8,18.76 25.2,17.36 25.2,16.34 24.94,16.09 24.94,14.57 25.58,13.93 25.58,13.42 USB2.6
HUB_DM3: length 5.8
  Top Layer w0.254: 7.5,20.73 7.5,17.4 8.65,16.25 USB3.2
HUB_DM4: length 8.9
  Top Layer w0.254: 6.22,20.73 6.22,19.06 v1(6.27,19.01)
  Bottom Layer w0.254: USB3.6 8.18,13.32 8.18,14.31 7.42,15.07 7.42,16.6 6.91,17.11 6.91,18.38 v1(6.27,19.01)
HUB_DP1: length 20.3
  Top Layer w0.254: 10.7,20.73 10.7,19.53 10.85,19.39 24.21,19.39 USB2.3
HUB_DP2: length 24.8
  Top Layer w0.254: USB2.7 27.61,13.39 27.61,13.68 27.23,14.06 25.45,14.06 24.94,14.57 24.94,16.09 25.2,16.34 25.2,17.36 23.93,18.63 10.44,18.63 9.42,19.65 9.42,20.73
HUB_DP3: length 6.3
  Top Layer w0.254: USB3.3 10.65,15.49 8.14,18 8.14,20.73
HUB_DP4: length 10
  Top Layer w0.254: 6.86,20.73 6.86,17.15 7.42,16.6 7.42,15.07 8.18,14.31 9.19,14.31 10.65,12.86 USB3.7
I2C-SCL: length 32.4
  Top Layer w0.18: U6.67 50.2,69.8 50.89,70.49 50.89,71.5 52.76,73.37 53.26,73.37 v1(53.52,73.62)
  Top Layer w0.254: U12.3 57.19,85.54 57.25,85.61 57.25,86.83
  Bottom Layer w0.18: v1(57.2,86.19) 58.12,85.28 58.12,74.03 58.06,73.97 53.87,73.97 v1(53.52,73.62) 53.52,72.79 54.08,72.22 54.41,72.22 54.41,69.69 55.94,68.15 57.07,68.15
I2C-SDA: length 39.3
  Top Layer w0.18: U6.66 49.59,68.6 49.41,68.78 49.41,71.61 49.52,71.72 50.47,71.72 52.63,73.88 v1(52.63,74.26) ; v1(54.28,72.99) 53.77,72.48 v1(52.88,72.48)
  Top Layer w0.254: R31.1 v1(54.1,85.93) 54.1,85.56 54.12,85.54 U12.4
  Bottom Layer w0.18: 54.15,85.94 54.61,85.49 57.4,85.49 57.84,85.05 57.84,74.26 v1(52.63,74.26) 52.63,73.62 53.01,73.24 53.01,72.61 v1(52.88,72.48) ; v1(54.28,72.99) 54.41,72.99 54.54,72.86 54.69,72.89 54.69,70.17 55.04,69.81 56.66,69.81 CN1.4
I2S-BCK: length 62.9
  Top Layer w0.254: U9.1 17.26,44.16 16.31,44.16 ; v1(55.93,51.27) 56.36,51.7 56.36,60.74 54.91,62.19 54.53,62.19 54.53,65.75 54.28,66 53,66 U6.30
  Bottom Layer w0.254: 55.93,51.14 55.93,50.86 55.42,50.36 45.12,50.36 44.64,49.87 43.09,49.87 42.76,50.2 30.73,50.2 24.3,43.78 23.36,43.78 22.47,44.67 22.08,44.67 21.07,43.65 17.05,43.65 16.67,44.03 v1(16.31,44.03)
I2S-DOUT: length 69.8
  Top Layer w0.254: 15.8,44.67 16.37,44.67 U9.12 ; U6.33 52.93,69.43 54.28,69.43 55.42,68.29 55.42,62.83 57.07,61.18 57.07,51.65 57.58,51.14 v1(57.58,50.51)
  Bottom Layer w0.254: v1(15.7,44.67) 15.7,43.25 15.93,43.02 24.55,43.02 31.02,49.49 42.47,49.49 42.85,49.11 44.88,49.11 45.39,49.62 55.93,49.62 56.74,50.43 57.51,50.43 v1(57.58,50.51)
I2S-LRCK: length 61.8
  Top Layer w0.254: v1(22.28,44.03) 22.03,43.79 19.72,43.79 19.61,43.9 18.37,43.9 18.09,44.19 U9.2 ; U6.31 54.2,67.2 55.04,66.36 55.04,62.57 56.72,60.9 56.72,51.04 v1(56.69,51.02)
  Bottom Layer w0.254: v1(22.28,44.03) 22.28,43.4 24.43,43.4 30.88,49.85 42.62,49.85 43,49.47 44.73,49.47 45.27,50 55.68,50 v1(56.69,51.02)
I2S-MCLK: length 54
  Top Layer w0.254: U6.26 52.92,61.68 54.91,61.68 56.01,60.59 56.01,52.36 v1(55.17,51.52) ; v1(19.99,44.41) 19.92,44.48 U9.3
  Bottom Layer w0.254: v1(55.17,51.52) 55.17,51.22 54.66,50.71 44.97,50.71 44.49,50.23 43.24,50.23 42.91,50.56 30.58,50.56 24.16,44.13 23.5,44.13 22.62,45.02 21.94,45.02 20.95,44.03 20.37,44.03 v1(19.99,44.41)
L-SPKN: length 43.2
  Top Layer w0.254: R22.2 v1(25.34,47.84) C49.2 ; C52.1 17.92,25.49 v1(16.56,25.49)
  Bottom Layer w0.254: 16.31,25.62 16.31,25.88 12.5,29.69 12.5,47.33 13.49,48.32 23.94,48.32 24.44,48.82 24.44,49.24 24.95,49.76 25.42,49.76 25.81,49.36 25.81,48.73 25.65,48.57 25.45,48.57 25.45,47.96 v1(25.34,47.84)
L-SPKP: length 38.5
  Top Layer w0.254: R21.2 v1(25.23,49.11) C48.1 ; C51.1 16.81,26.76
  Bottom Layer w0.254: v1(25.23,49.11) 24.09,47.97 13.64,47.97 12.88,47.21 12.88,29.81 15.8,26.89 16.56,26.89
  vias: v1(16.66,26.76)
LCD-CLK: length 16
  Top Layer w0.18: U6.53 39.73,59.78 v1(39.42,59.78)
  Bottom Layer w0.18: CN2.6 30.4,56.06 30.4,54.77 30.6,54.58 30.6,53.75 32.31,53.75 37.42,58.86 38.63,58.86 39.42,59.65 v1(39.42,59.78)
LCD-CS: length 23
  Top Layer w0.18: v1(41.2,60.03) 41.07,60.16 41.07,60.54 41.01,60.54 U6.52
  Bottom Layer w0.18: v1(41.2,60.03) 41.2,58.94 41.02,58.76 40.63,58.76 39.97,59.43 39.97,60.05 39.69,60.33 39.19,60.33 38.87,60.01 38.87,59.61 38.4,59.14 37.3,59.14 32.19,54.03 30.88,54.03 30.88,54.69 30.69,54.88 30.69,56.18 30.26,56.61 30.38,56.73 30.38,58.4 29.82,58.97 CN2.5
LCD-DOUT: length 30.6
  Top Layer w0.18: CN2.3 26.97,57.49 26.97,58.13 26.59,58.51 26.59,59.27 27.23,59.91 27.73,59.91 27.98,59.66 29.49,61.17 29.49,62.19 29.26,62.19 v1(28.88,62.57) ; v1(33.71,67.78) 33.09,67.78 32.68,67.37 30.01,67.37 28.75,66.11 28.75,65.49 ; U6.50 40.65,63.8 40.82,63.97 v1(40.94,63.97)
  Bottom Layer w0.18: v1(33.71,67.78) 33.96,68.03 34.09,68.03 34.09,68.51 34.47,68.89 39.9,68.89 39.9,65.63 40.31,65.22 40.31,64.61 v1(40.94,63.97) ; v1(28.85,65.49) 28.85,62.7
LCD-RS: length 28.4
  Top Layer w0.18: U6.51 40.5,62.95 v1(40.82,62.95) ; v1(29.77,65.62) 29.77,65.75 29.28,66.24 29.3,66.26 29.52,66.26 30.28,67.02 32.82,67.02 33.13,67.33 33.39,67.33 33.71,67.02 v1(33.96,67.02) ; CN2.4 27.69,58.97 29.9,61.18 v1(29.9,62.57)
  Bottom Layer w0.18: v1(40.82,62.95) 40.31,63.46 40.31,64.21 40.03,64.49 40.03,65.11 39.62,65.51 39.62,68.61 34.59,68.61 34.37,68.4 34.37,67.43 v1(33.96,67.02) ; v1(29.77,65.62) 29.13,64.99 29.13,63.09 29.65,62.57 v1(29.9,62.57)
LCD-RST: length 34.4
  Top Layer w0.18: v1(33.45,68.54) 32.56,67.65 29.9,67.65 28.5,66.26 27.99,66.26 27.99,65.88 v1(27.74,65.62) ; CN2.2 26.97,55.49 26.97,56.1 26.47,56.6 26.47,57.11 26.52,57.11 26.74,57.33 26.69,57.38 26.69,58.01 26.31,58.39 26.31,59.39 27.11,60.19 27.85,60.19 27.98,60.06 29.21,61.28 29.21,61.91 29.14,61.91 29.14,61.94 28.8,61.94 28.68,62.06 28.25,62.06 v1(27.74,62.57) ; U6.49 40.16,64.99 v1(40.94,64.99)
  Bottom Layer w0.18: 27.74,62.7 28.12,62.7 28.5,63.08 28.5,65.07 27.95,65.62 v1(27.74,65.62) ; 33.71,68.54 34.34,69.18 40.06,69.18 40.18,69.05 40.18,65.75 v1(40.94,64.99)
LCD-TE: length 22.9
  Top Layer w0.18: v1(42.98,60.03) 42.98,61.81 43.27,62.1 43.27,63.17 v1(42.85,63.59)
  Top Layer w0.254: U6.78 42.46,63.2 42.72,63.46
  Bottom Layer w0.254: CN2.7 29.75,54.97 30.28,54.44 30.28,53.56 30.4,53.43 32.44,53.43 37.55,58.54 39.19,58.54 39.17,58.56 39.17,58.89 39.29,59.02 39.93,59.02 40.31,58.64 40.31,58.57 40.44,58.44 41.39,58.44 v1(42.98,60.03)
M-CTS: length 49.9
  Top Layer w0.254: R36.2 19.81,60.49 19.99,60.67 19.99,62.32 20.12,62.45 22.91,62.45 22.91,63.21 23.46,63.76 31.51,63.76 31.72,63.55 31.72,52.12 32.4,51.45 43.36,51.45 43.66,51.14 43.68,51.14 43.91,50.9 44.27,50.9 46.16,52.79 48.82,52.79 49.55,53.53 U6.22
M-RTS: length 56.7
  Top Layer w0.254: U6.23 52.88,58.38 52.88,53.94 52.47,53.53 50.05,53.53 48.97,52.44 46.31,52.44 44.42,50.55 43.77,50.55 43.53,50.79 43.51,50.79 43.21,51.09 32.25,51.09 31.37,51.97 31.37,63.4 ; R37.2 17.76,59.93 20.01,59.93 20.37,60.29 20.37,62.06 23.04,62.06 23.42,62.45 23.42,63.08 23.74,63.4 31.37,63.4
M-RXD: length 35.8
  Top Layer w0.254: R33.1 25.88,64.22 31.55,64.22 32.08,63.7 32.08,52.27 32.54,51.8 43.99,51.8 43.99,51.65 v1(44.09,51.55) ; U6.17 44.05,52.98 v1(43.99,52.92)
  Bottom Layer w0.254: v1(43.99,52.92) 44.09,52.82 v1(44.09,51.55)
M-TXD: length 36.4
  Top Layer w0.254: R32.1 25.38,65.92 26.08,65.22 26.08,64.61 31.67,64.61 32.44,63.84 32.44,52.41 32.69,52.16 44.38,52.16 44.63,52.41 44.63,54.57 45.15,55.09 U6.18
NET_STATUS: length 60.7
  Top Layer w0.254: v1(59.11,61.3) 59.39,61.58 59.39,88.2 58.95,88.63 53.75,88.63 52.83,89.55 R9.2 ; U6.16 42.95,54.19
  Bottom Layer w0.254: v1(59.11,61.3) 59.36,61.05 59.36,54.7 58.6,53.94 43.2,53.94 42.95,54.19 v1(42.95,54.3)
R-SPKN: length 10.7
  Top Layer w0.254: C57.1 v1(10.72,39.77) ; R20.2 10.63,46.95
  Bottom Layer w0.254: v1(11.25,47.07) 11.25,46.6 10.29,45.63 10.29,40.21 v1(10.72,39.77)
R-SPKP: length 7.5
  Top Layer w0.254: C56.1 11.1,41.17 ; R19.2 v1(11.4,45.68) 10.76,45.68 10.63,45.56
  Bottom Layer w0.254: v1(11.4,45.68) 10.64,44.92 10.64,41.69 v1(11.1,41.24)
RESET_N: length 85.6
  Top Layer w0.254: U6.15 v1(41.85,54.57) ; 37.73,96.34 37.73,96.19 34.5,92.96 C23.2 R12.2 36.32,90.24 36.69,89.88 46.79,89.88 48.82,87.85 58.6,87.85 58.6,63.72 57.96,63.08 v1(57.96,61.68)
  Bottom Layer w0.254: v1(41.85,54.57) 42.34,54.57 42.85,55.08 43.1,55.08 43.74,54.44 43.74,54.32 58.47,54.32 58.47,61.3 57.96,61.81
SIM1-CLK: length 51.4
  Top Layer w0.254: v1(31.17,73.62) 31.93,74.38 31.93,75.15 v1(31.17,75.91) ; v1(33.83,62.83) 33.83,61.18 33.33,60.67 33.33,59.71 33.69,59.35 34.83,59.35 35.36,58.81 36.99,58.81 U6.13 ; C66.1 19.61,89.12
  Bottom Layer w0.254: 18.97,84.8 18.97,83.02 19.48,82.51 30.28,82.51 30.91,83.15 32.06,83.15 32.69,82.51 32.69,80.99 31.29,79.59 31.29,76.03 ; SIM1.3 18.97,85.61 19.61,86.25 v1(19.61,89) ; v1(31.17,73.62) 31.17,65.88 33.83,63.21 v1(33.83,62.83)
SIM1-DATA: length 50.3
  Top Layer w0.254: U6.11 36.69,60.6 36.25,60.16 35.61,60.16 35.15,59.7 33.83,59.7 33.83,60.48 34.59,61.24 v1(34.59,62.45) ; C67.1 20.88,89.12 ; v1(31.93,76.03) 32.31,75.65 32.31,73.75 v1(32.06,73.5)
  Bottom Layer w0.254: v1(31.93,76.03) 31.65,76.31 31.65,79.44 33.05,80.84 33.05,82.66 32.2,83.5 30.76,83.5 30.13,82.87 28.02,82.87 27.99,82.89 20.24,82.89 SIM1.7 20.24,85.61 20.88,86.25 v1(20.88,88.91) ; v1(34.59,62.45) 34.59,62.95 31.52,66.03 31.52,72.96 v1(32.06,73.5)
SIM1-DET: length 49.5
  Top Layer w0.254: R29.2 26.85,90.46 26.34,90.46 26.34,89.24 ; v1(42.72,62.45) 42.28,62 U6.79 ; v1(34.59,73.5) 33.58,74.51 33.58,74.73 v1(34.4,75.56)
  Bottom Layer w0.254: 34.21,75.65 34.19,75.65 33.81,76.03 33.81,76.36 32.76,77.41 32.72,77.41 32.72,79 34.11,80.4 34.11,83.1 32.65,84.57 30.29,84.57 29.7,83.99 26.59,83.99 26.59,84.59 SIM1.8 26.47,85.11 v1(26.47,89.12) ; v1(42.72,62.45) 42.72,62.19 35.83,62.19 35.83,63.18 35.43,63.58 35.43,64.33 35.09,64.68 34.68,64.68 32.59,66.76 32.59,72 32.82,72.22 33.76,72.22 34.59,73.06 v1(34.59,73.5)
SIM1-RST: length 49.2
  Top Layer w0.254: v1(34.47,60.29) 35.18,61 35.18,62.9 v1(35.23,62.95) ; v1(32.94,73.5) 32.69,73.75 v1(32.69,76.11) ; U6.12 37.3,59.4 v1(35.74,59.4) ; C65.1 v1(22.15,89.12)
  Bottom Layer w0.254: v1(35.23,62.95) 35.1,62.95 31.88,66.17 31.88,72.81 31.92,72.86 32.31,72.86 v1(32.94,73.5) ; v1(34.47,60.29) 35.36,59.4 v1(35.74,59.4) ; v1(22.15,89.12) 22.15,86.25 21.51,85.61 SIM1.2 21.51,83.27 25.32,83.27 25.35,83.25 28.14,83.25 28.16,83.22 29.95,83.22 30.58,83.86 32.35,83.86 33.4,82.81 33.4,80.69 32,79.3 32,76.8 v1(32.69,76.11) 32.69,75.91
SIM1-VDD: length 60.9
  Top Layer w0.254: 23.42,89.12 C64.1 C68.1 ; v1(33.33,75.65) 33.45,75.53 33.45,75.17 33.07,74.79 33.07,74.36 33.58,73.85 33.58,73.5 v1(33.71,73.37) ; U6.14 40.82,56.23 40.82,54.32 36.88,54.32 35.61,55.59 35.61,58 34.62,58.99 33.54,58.99 32.97,59.56 32.97,60.82 33.33,61.17 33.33,61.43 33.2,61.56 33.2,63.46 34.21,63.46 v1(34.84,64.09)
  Bottom Layer w0.254: 33.45,75.53 33.45,76.21 32.62,77.05 32.36,77.05 32.36,79.15 33.76,80.55 33.76,82.95 32.5,84.22 30.43,84.22 29.85,83.63 24.05,83.63 SIM1.1 24.05,85 23.8,85.25 23.8,88.61 v1(23.42,88.99) ; v1(33.71,73.37) 32.94,72.61 32.56,72.61 32.46,72.5 32.23,72.5 32.23,66.32 34.46,64.09 v1(34.84,64.09) 34.98,64.22
SIM2-CLK: length 27
  Top Layer w0.254: U8.6 v1(50.22,83.78) ; 49.45,63.84 49.5,63.8 U6.62
  Bottom Layer w0.254: v1(50.22,83.78) 50.22,84.1 49.34,84.98 48.49,84.98 48.06,84.54 48.06,82.88 49.51,81.43 49.51,68.64 49.55,68.64 50.32,67.88 50.32,65.24 49.83,64.76 49.79,64.76 49.79,64.43 49.34,63.99 v1(49.33,63.99)
SIM2-DAT: length 36.3
  Top Layer w0.254: v1(42.56,83.86) 43.28,83.86 U8.3 ; v1(42.56,83.86) 42.47,83.77 42.47,81.5 51.18,81.5 R18.1 ; v1(42.56,83.86) R17.1 ; U6.64 49.45,66.2
  Bottom Layer w0.254: v1(42.56,83.86) 45.57,83.86 48.44,80.99 48.44,67.02 49.07,66.38 v1(49.33,66.38)
SIM2-RST: length 25.9
  Top Layer w0.254: U6.63 49.45,65 ; v1(50.09,85.05) U8.7
  Bottom Layer w0.254: v1(49.33,65.11) 49.69,65.11 49.96,65.39 49.96,67.73 49.4,68.29 49.15,68.29 49.15,81.28 47.65,82.78 47.65,84.78 48.2,85.33 49.81,85.33 v1(50.09,85.05)
SIM2-VDD: length 30
  Top Layer w0.254: 51.19,86.32 51.32,86.19 C38.2 51.61,84.89 51.61,83.02 51.87,83.02 52.38,82.51 52.38,82.18 R18.2 ; 51.19,86.32 C37.2 ; 51.19,86.32 v1(50.22,86.32) U8.8 ; U6.65 49.45,67.4
  Bottom Layer w0.254: v1(50.22,86.32) 49.58,85.69 48.06,85.69 47.3,84.92 47.3,82.63 48.79,81.14 48.79,67.92 v1(49.32,67.4)
STATUS: length 38.9
  Top Layer w0.254: R11.2 56.51,90.24 57.77,88.99 59.11,88.99 59.74,88.35 59.74,60.89 59.39,60.54 v1(57.71,60.54) ; v1(54.44,60.64) 52.94,60.64 U6.25
  Bottom Layer w0.254: v1(57.71,60.54) 57.61,60.64 v1(54.44,60.64)
USB-VBUS: length 263.2
  Top Layer w0.254: v1(24.69,81.37) 24.69,81.75 24.94,82 ; 12.37,31.24 12.37,29.84 C14.2 10.76,28.16 9.19,28.16 8.81,27.78 8.81,26.19 8.78,26.16 ; 12.37,31.24 12.37,32.47 9.58,35.27 v3(2.08,35.27) ; 12.37,31.24 C13.2 ; 30.33,82.07 U5.3 ; 12.97,77.38 C5.2 ; 12.97,77.38 C6.2 12.97,75.74 11.86,74.64 8.43,74.64 8.31,74.51 8.31,73.1 U1.12 ; 12.97,77.38 14.27,78.69 ; 15.52,77.49 15.67,77.65 15.67,78.45 16.38,79.16 R3.2 16.38,80.49 C17.2 ; U6.61 50.85,62.6 ; 24.94,82 C20.1 ; 24.94,82 25.12,82.18 R6.2
  Top Layer w0.5: v1(31.42,81.88) 31.36,81.94 U5.3 ; 12.52,88.96 11.55,89.94 USB1.2 ; USB1.11 6.75,91.83 6.27,91.35 v3(6.27,88.96) 6.27,87.32 C7.1
  Top Layer w1: 14.27,85.43 14.27,78.45 v1(14.88,77.84) 15.23,77.49 15.52,77.49 ; 14.27,85.43 13.77,85.94 13.77,87.72 12.52,88.96 v3(6.27,88.96) ; 14.27,85.43 14.28,85.43 16.31,83.4
  Bottom Layer w0.254: v1(50.98,62.57) 50.22,61.81 11.61,61.81 10.72,62.7 10.72,68.54 11.1,68.92 11.1,72.61 14.88,76.39 v1(14.88,77.84)
  Bottom Layer w0.5: v1(31.42,81.88) 30.91,81.37 v1(24.69,81.37) 18.34,81.37 v1(16.17,83.54)
  Bottom Layer w1: USB2.1 USB2.5 23.65,7.31 21.77,5.42 7.16,5.42 6.15,6.44 USB3.5 USB3.1 5.89,15.71 5.89,17.74 5.39,18.25 3.23,18.25 1.9,19.57 1.9,84.59 v3(6.27,88.96)
  vias: v1(1.96,52.67)
USB_BOOT: length 59.7
  Top Layer w0.254: 58.47,62.57 59.03,63.13 59.03,88.05 58.8,88.28 48.99,88.28 47.12,90.15 R14.2 ; U6.82 47.9,62.45 v1(47.55,62.45) ; R14.2 C24.2 ; R14.2 47.12,96.19 47.26,96.34
  Bottom Layer w0.254: v1(47.55,62.45) 47.93,62.45 48.21,62.17 50.07,62.17 50.07,62.55 50.67,63.16 51.22,63.16 51.8,62.57 58.47,62.57 v1(58.56,62.66)
$1N678: length 6.6
  Top Layer w0.254: 10.12,76.16 10.12,75.53 9.87,75.27 8.05,75.27 7.67,74.89 7.67,73.1 U1.13
  Top Layer w0.5: 10.12,77.56 10.12,76.16
$1N707: length 8.9
  Top Layer w0.254: C1.2 6.66,79.11 6.66,78.21 ; U1.16 5.69,73.83 v1(5,74.51)
  Bottom Layer w0.254: v1(5,74.51) 6.5,76.01 v1(6.5,79.27)
$1N726: length 6.8
  Top Layer w0.254: USB1.10 7.4,94.67 6.91,95.16 R1.1
$1N727: length 6.7
  Top Layer w0.254: R2.1 11.23,95.03 10.4,94.21 USB1.4
$1N731: length 6.3
  Top Layer w0.254: U1.15 6.33,74.6 X1.1 4.17,76.76 C2.1
$1N1108: length 5.8
  Top Layer w0.254: 8.14,26.16 8.14,28.12 9.74,29.72 C12.2 9.74,29.93 C11.2
$1N1137: length 9
  Top Layer w0.254: C9.2 v1(6.36,32.81) X2.3 ; 5.64,27.52 6.22,26.94 6.22,26.16
  Bottom Layer w0.254: v1(6.36,32.81) 6.36,28.34 v1(5.64,27.62)
$1N1138: length 7.1
  Top Layer w0.254: 6.86,26.16 6.86,27.37 X2.1 3.96,30.28 C10.1
$2N388: length 2.9
  Top Layer w0.5: L1.1 20.36,77.49 18.12,77.49
$2N391: length 5.1
  Top Layer w0.254: U3.1 17.13,75.59 16.56,76.16 16.56,77.94 17.25,78.63 R3.1
$2N396: length 2.8
  Top Layer w0.254: R4.2 R5.1 15.37,74.97 15.52,75.12 U3.5
$2N960: length 1.8
  Top Layer w0.254: C18.1 27.93,78.59 U5.6
$2N963: length 1.6
  Top Layer w0.254: R6.1 26.65,81.32 27.1,80.86 27.81,80.86 U5.5
$2N966: length 6.7
  Top Layer w0.254: U5.2 30.08,80.73 29.9,80.73 29.13,79.97 29.3,79.81 C18.2
  Top Layer w0.5: L2.2 33.38,80.73 30.91,80.73 30.66,80.99 U5.2
$2N969: length 6.2
  Top Layer w0.254: 32.36,85.31 32.36,84.98 31.8,84.42 31.8,84.09 R7.2 29.78,83.78 U5.4
$3N1705: length 4.1
  Top Layer w0.254: LED1.1 53.86,99.02 53.14,99.02 53.14,96.74 52.95,96.55 53.09,96.41 R10.2
$3N1706: length 4.4
  Top Layer w0.254: Q1.3 51.76,94.72 51.99,94.96 53.39,94.96 53.95,95.52 R10.1
$3N1709: length 1.9
  Top Layer w0.254: Q1.1 53.76,90.44 R9.1
$3N1711: length 3.5
  Top Layer w0.254: LED2.1 56.62,98.37 R13.2
$3N1712: length 4.4
  Top Layer w0.254: R13.1 55.75,95.01 55.8,94.96 57.33,94.96 57.69,94.59 Q2.3
$3N1715: length 4.2
  Top Layer w0.254: Q2.1 55.69,93.65 57.07,92.27 57.07,91.91 57.38,91.6 R11.1
$3N1912: length 5
  Top Layer w0.254: R15.1 55.64,74.24 C33.2 55.64,72.44 54.8,71.6 U6.35
$3N2096: length 2.8
  Top Layer w0.254: R15.2 55.64,75.29 C31.2 55.55,76.63 RF1.4
$3N2500: length 4.1
  Top Layer w0.254: R16.1 33.47,70.41 C32.2 37.31,70.41 U6.2
$3N4181: length 1.7
  Top Layer w0.254: R17.2 42.16,85.05 U8.2
$3N9244: length 11
  Top Layer w0.127: U6.8 35.94,63.9 35.24,64.59 35.24,65.11 ; L7.2 32.69,68.92 32.94,69.18 34.61,69.18 35.24,68.54 35.24,65.11 ; 35.24,65.11 34,65.11
$3N9261: length 4.2
  Top Layer w0.254: C34.2 31.13,70.37 31.13,70.32 ; L7.1 31.13,70.32 ; 31.13,70.32 RF2.4 ; 32.51,70.32 31.26,70.32
$3N10691: length 3.8
  Top Layer w0.254: U4.9 22.9,64.47 23.04,64.61 23.04,64.86 23.67,65.49 23.88,65.49 R32.2
$3N10736: length 3.2
  Top Layer w0.254: U4.8 23.16,63.97 23.93,64.73 R33.2
$3N10788: length 1.8
  Top Layer w0.18: R34.2 23.71,55.97 22.55,55.97
$3N10833: length 1.9
  Top Layer w0.18: U7.6 23.24,54.7 23.93,54.01 R35.2
$3N10879: length 3.2
  Top Layer w0.254: U4.4 17.38,63.46 18.34,63.46 18.47,63.33 18.47,61.48 R36.1
$3N10924: length 2.4
  Top Layer w0.254: U4.5 17.69,62.97 17.96,62.7 17.96,62.12 R37.1
$4N293: length 1.9
  Top Layer w0.254: C39.2 20.96,45.18 U9.4
$4N296: length 2.1
  Top Layer w0.254: U9.5 20.46,45.68 C40.2
$4N522: length 1.3
  Top Layer w0.254: C42.1 16.88,45.69 U9.11
$4N527: length 1.6
  Top Layer w0.254: U9.10 16.75,46.32 16.43,46.32 15.8,46.95 C43.1
$4N680: length 1.5
  Top Layer w0.254: R19.1 12.94,45.69 C42.2
$4N683: length 1.6
  Top Layer w0.254: C43.2 R20.1
$4N1144: length 1.4
  Top Layer w0.254: C46.2 R21.1
$4N1146: length 1.4
  Top Layer w0.254: C47.2 23.48,47.83 R22.1
$4N1170: length 3.3
  Top Layer w0.254: U9.7 18.74,46.88 C46.1
$4N1181: length 2.4
  Top Layer w0.254: U9.6 19.36,46.18 C47.1
$4N1348: length 3.7
  Top Layer w0.254: U10.1 25.12,29.17 26.72,30.77
$4N1407: length 3
  Top Layer w0.254: U10.2 22.95,27.9 C50.2
$4N1651: length 2.2
  Top Layer w0.254: U10.3 23.51,26.76 R24.2
$4N1656: length 2.2
  Top Layer w0.254: U10.4 23.51,25.24 R25.2
$4N1661: length 1.4
  Top Layer w0.254: R24.1 C51.2
$4N1664: length 1.5
  Top Layer w0.254: C52.2 19.27,25.24 R25.1
$4N1818: length 2.4
  Top Layer w0.254: L3.1 29.17,29.04 U10.8
$4N1821: length 2.3
  Top Layer w0.254: L4.1 U10.5
$4N2066: length 21.8
  Top Layer w0.254: SPK1.1 46.71,17.61 46.71,19.85 43.18,23.38 38.14,23.38 32.47,29.04 32.56,29.13 C61.1
$4N2077: length 24.8
  Top Layer w0.254: SPK1.2 46.79,11.52 34.3,24 C60.2 32.47,24.09 32.47,25.36
$4N2586: length 3
  Top Layer w0.254: R26.1 20.06,40.6 U11.1
$4N2591: length 4.8
  Top Layer w0.254: C55.2 19.14,41.36 18.59,41.36 18.32,41.09 18.32,40.24 18.72,39.84 19.06,39.84 U11.2
$4N2595: length 5.9
  Top Layer w0.254: R27.2 17.01,41.17 17.32,40.86 17.32,39.33 18.47,38.19 19.44,38.19 U11.3
$4N2599: length 4.9
  Top Layer w0.254: R28.2 18.85,36.79 U11.4
$4N2603: length 1.8
  Top Layer w0.254: C56.2 R27.1
$4N2605: length 1.8
  Top Layer w0.254: C57.2 R28.1
$4N2611: length 2.6
  Top Layer w0.254: L5.1 27.36,40.6 U11.8
$4N2613: length 2.6
  Top Layer w0.254: U11.5 27.43,36.79 L6.1
$4N2619: length 23.6
  Top Layer w0.254: SPK2.1 43.82,38.7 31.17,38.7 29.64,40.22 29.64,42.09 29.39,42.34 C62.1 28.75,40.62 L5.2
$4N2624: length 22.2
  Top Layer w0.254: SPK2.2 46.53,31.66 46.53,32.73 42.57,36.69 28.63,36.69 ; 28.63,36.69 C63.2 ; 28.63,36.69 L6.2

## Copper pours and planes (outline as drawn; the poured copper is in the pictures)
GND on Top Layer: -6.04,105.75 73.33,105.75 73.33,-1.82 -6.04,-1.82
GND on Bottom Layer: -2.62,113.75 63.42,113.75 63.42,-3.09 -2.62,-3.09

Small or netless copper shapes (teardrops, artwork), in the pictures only: 762 on Top Layer, 188 on Bottom Layer

## Text on the board
Bottom Silkscreen Layer: RS | DOUT | RST | 3V3 | LCD | GPIO20 | GPIO25 | GPIO21 | CS | CLK | TE | GND | ADC0 | ADC1 | SDA | SCL | BY 何亚红 | 扩展板-002 V2024.05.18 | 4G上网模块: / -采用Air780EG / -温湿度检测 / -引出4G模块串口(采用CH340) / -自带USB HUB，可连接至USB口少（如只有1个USB口）的模块。
Top Silkscreen Layer: GNSS | RESET | BOOT | LTE | STATUS | NET | ESIM(默认不焊)
